# EasyEDA Pro project H桥.eprj, board 单相_TO220
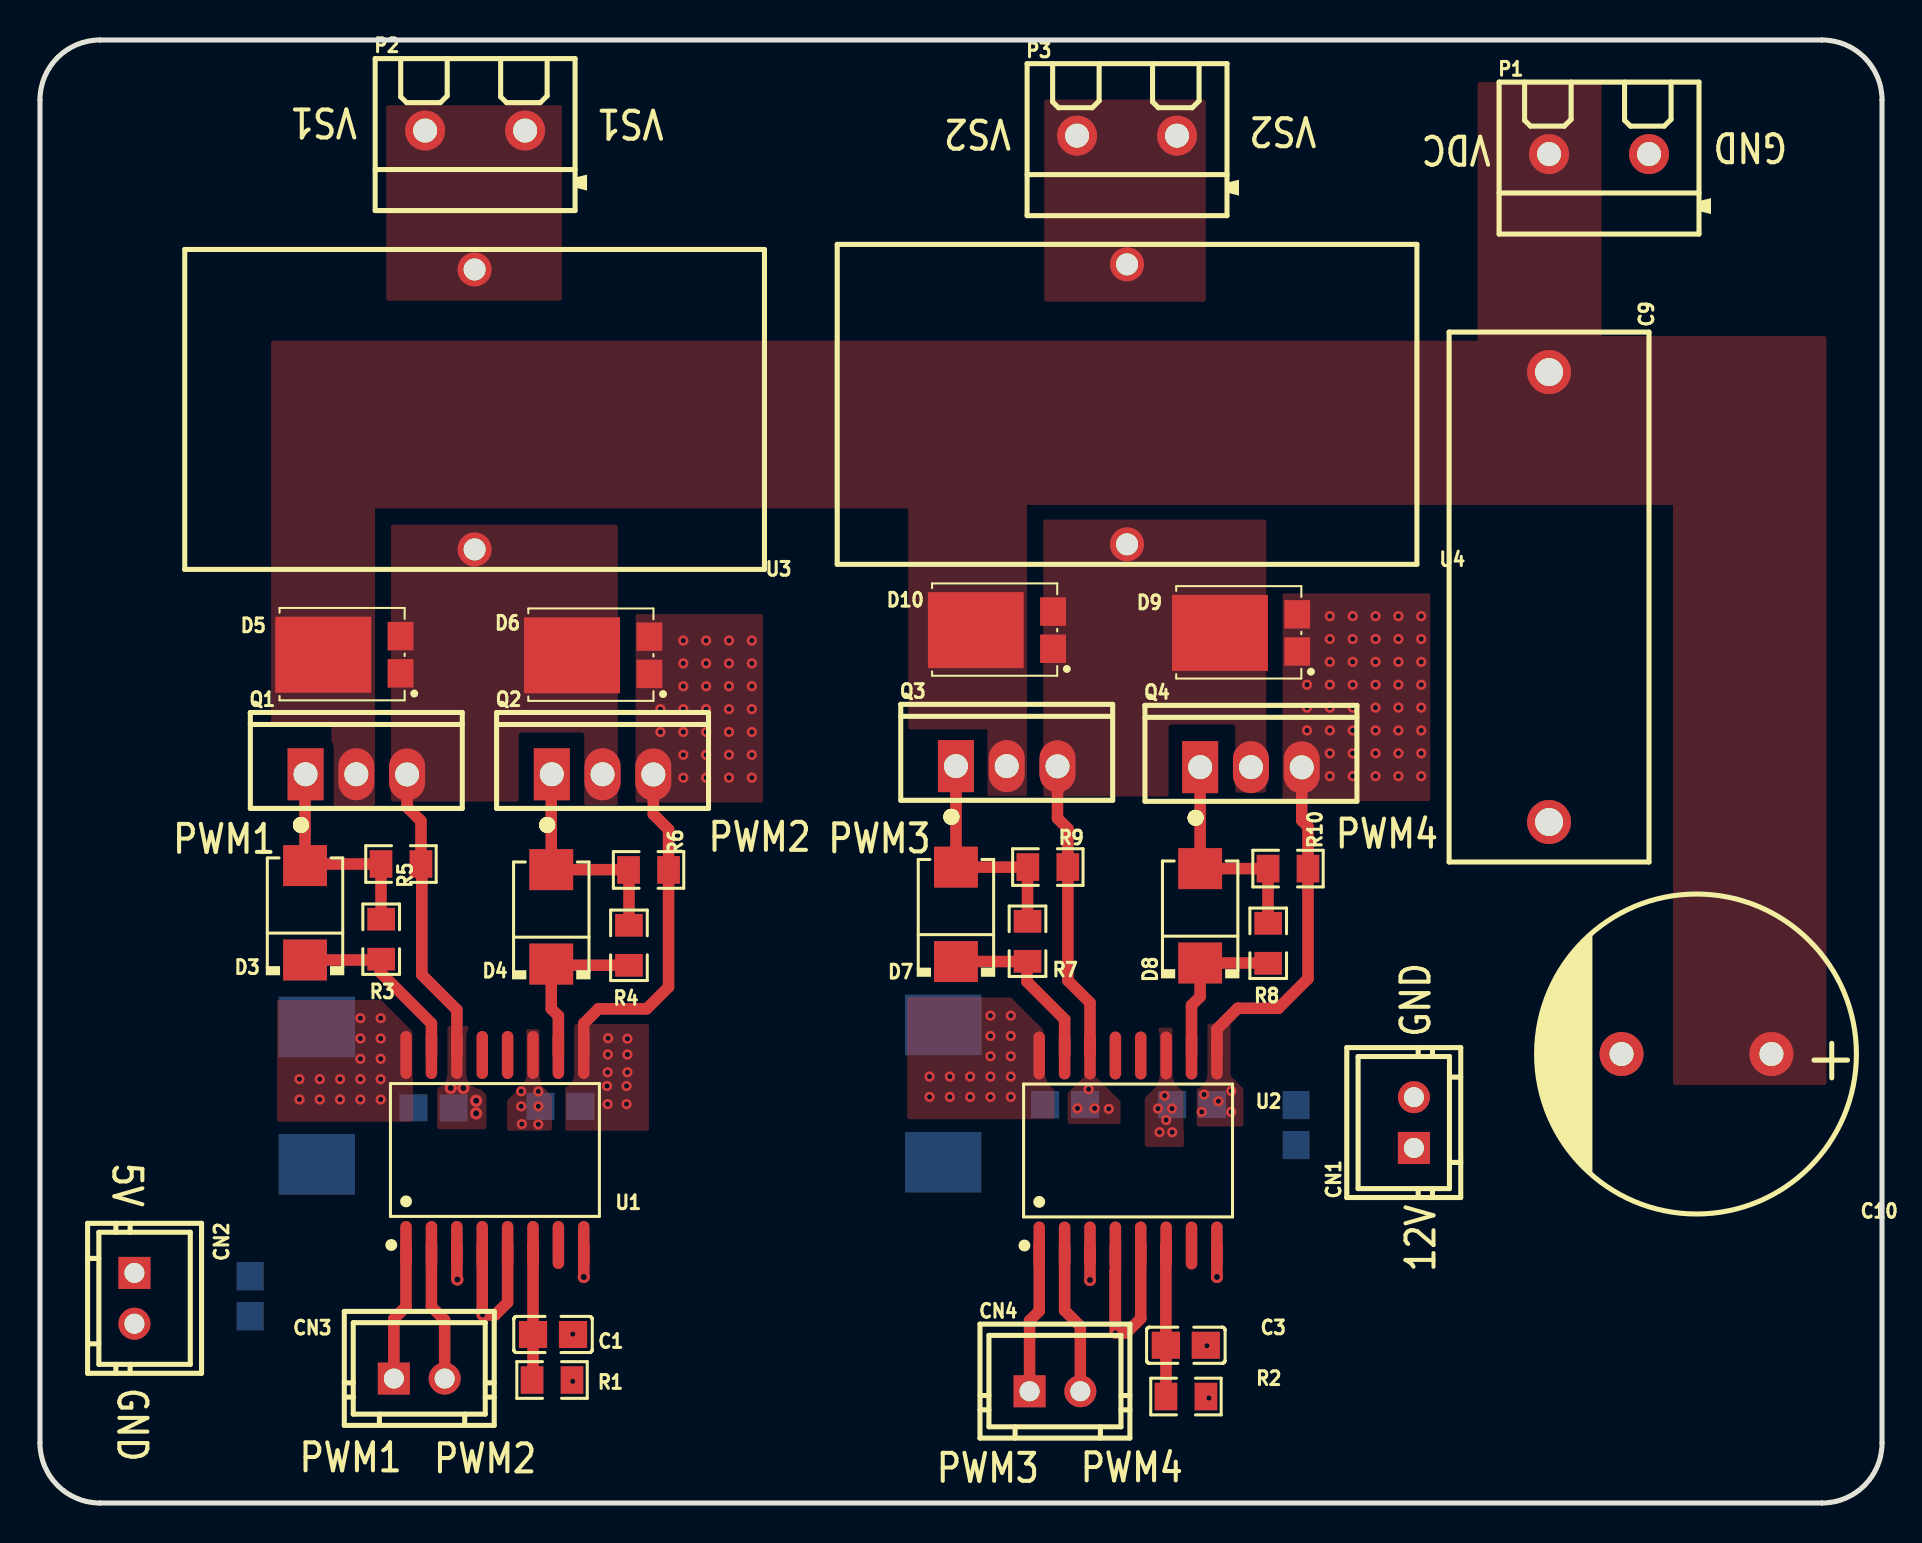
[diagram p3: board, top side]
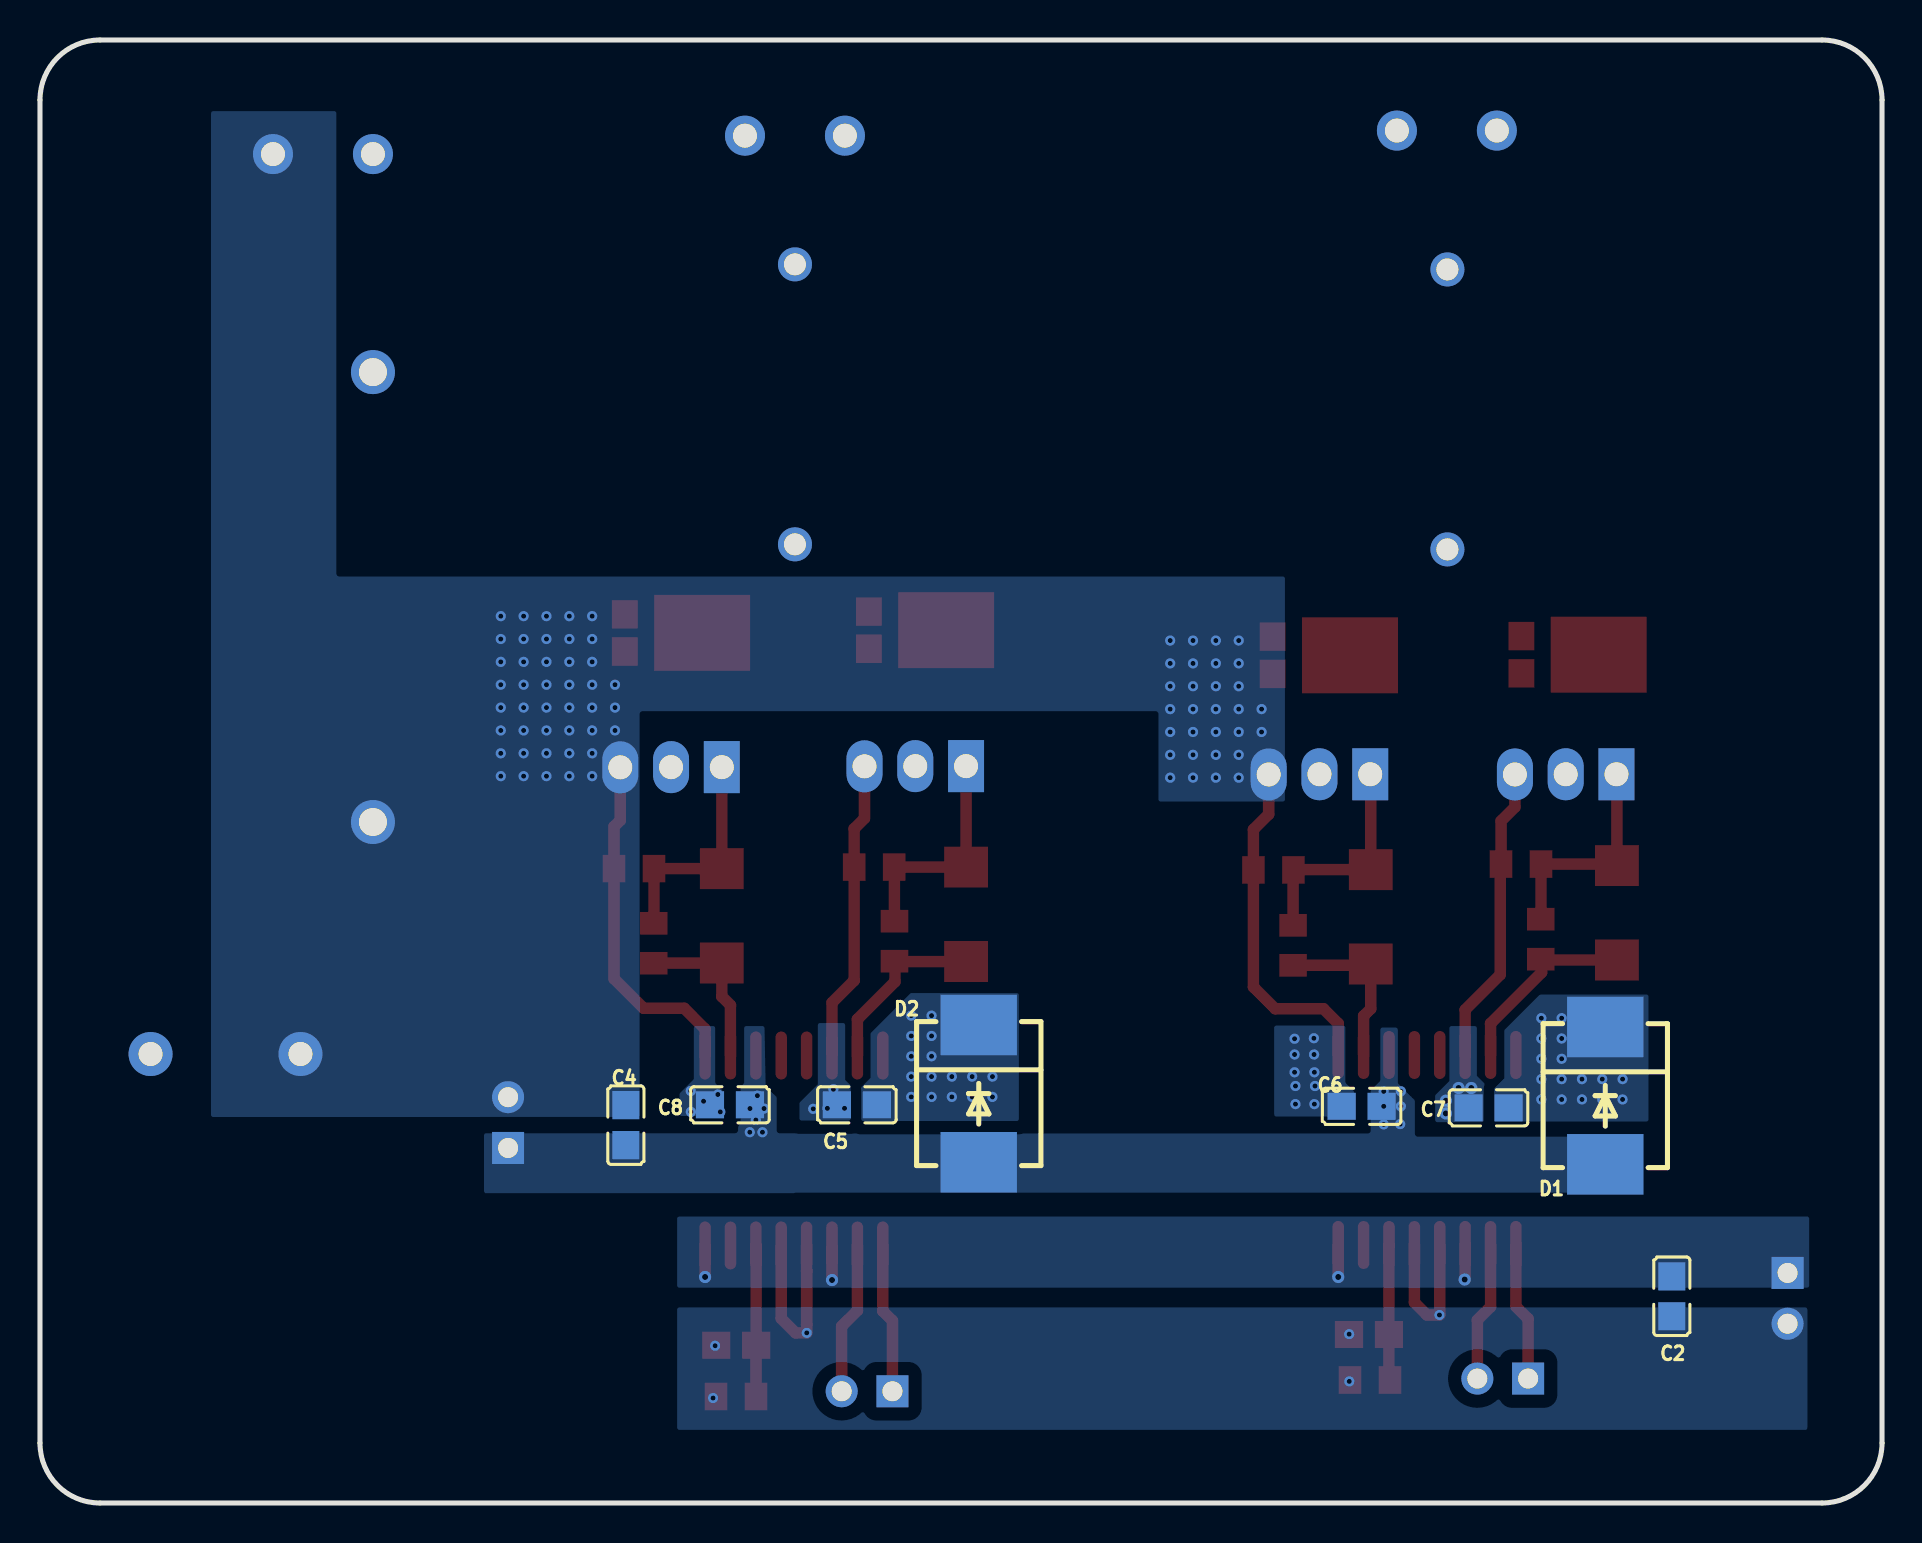
[diagram p4: board, bottom side, seen from below]

Outline 92.15 x 73.16 mm; copper layers: Top Layer, Bottom Layer. Coordinates in mm from the lower left corner of the outline.
Outline path: 0,70.16 0,3 arc(0.88,0.88) 3,0 89.15,0 arc(91.27,0.88) 92.15,3 92.15,70.16 arc(91.27,72.28) 89.15,73.16 3,73.16 arc(0.88,72.28) 0,70.16
Stack: Top Layer 0.035mm / Dielectric1 1.51mm FR4 er 4.5 / Bottom Layer 0.035mm

## Design rules (mm)
template: 自定义配置
spacing copperThickness1oz (default): track to track 0.508, other pairs 0.508 to 0.508
spacing copperThickness2oz: track to track 0.203, other pairs 0.152 to 0.3
track width copperThickness1oz (default): min 0.127, default 0.254, max 2.54
track width copperThickness2oz: min 0.203, default 0.254, max 2.54
differential pair differentialPair (default): width min 0.127, default 0.254, max 2.54; gap min 0.152, default 0.152
via viaSize (default): diameter min 0.5, default 0.508, max 10; hole min 0.127, default 0.254, max 6.3

## Placement (name value [footprint] x y rotation side)
C1  100nF  [C0805]  25.67 8.43 180 top
C2  100nF  [C0805]  10.52 10.34 90 bottom
C3  100nF  [C0805]  57.32 7.89 180 top
C4  100nF  [C0805]  62.84 18.9 270 bottom
C5  1uF  [C0805]  51.28 19.91 180 bottom
C6  1uF  [C0805]  26.03 19.84 180 bottom
C7  1uF  [C0805]  19.69 19.76 180 bottom
C8  1uF  [C0805]  57.63 19.91 180 bottom
C9  1uF  [CAP-TH_L26.5-W10.0-P22.50-D1.4]  75.49 45.3 270 top
C10  470uF  [CAP-TH_BD16.0-P7.50-D1.2-FD]  82.87 22.45 180 top
CN1  CON2-2.54*2P  [CONN-TH_2P-P2.54-V]  68.73 19.02 90 top
CN2  CON2-2.54*2P  [CONN-TH_2P-P2.54-V]  4.72 10.24 270 top
CN3  CON2-2.54*2P  [CONN-TH_2P-P2.54-V]  18.97 6.22 0 top
CN4  CON2-2.54*2P  [CONN-TH_2P-P2.54-V]  50.77 5.59 0 top
D1  RS3MC  [SMC_L7.1-W6.2-LS8.1-R-RD]  13.84 20.37 270 bottom
D2  RS3MC  [SMC_L7.1-W6.2-LS8.1-R-RD]  45.19 20.47 270 bottom
D3  SS34BG  [SMB_L4.6-W3.6-LS5.3-RD]  13.26 29.51 90 top
D4  SS34BG  [SMB_L4.6-W3.6-LS5.3-RD]  25.58 29.31 90 top
D5  ST20100L  [TO-277_3P-L5.7-W4.2-LS6.5-BR]  16.1 42.42 0 top
D6  ST20100L  [TO-277_3P-L5.7-W4.2-LS6.5-BR]  28.55 42.39 0 top
D7  SS34BG  [SMB_L4.6-W3.6-LS5.3-RD]  45.82 29.44 90 top
D8  SS34BG  [SMB_L4.6-W3.6-LS5.3-RD]  58.04 29.36 90 top
D9  ST20100L  [TO-277_3P-L5.7-W4.2-LS6.5-BR]  60.96 43.51 0 top
D10  ST20100L  [TO-277_3P-L5.7-W4.2-LS6.5-BR]  48.75 43.65 0 top
P1  KF301-2P接线端子  [CONN-TH_XY301V-A-5.0-2P]  77.99 67.45 0 top
P2  KF301-2P接线端子  [CONN-TH_XY301V-A-5.0-2P]  21.77 68.63 0 top
P3  KF301-2P接线端子  [CONN-TH_XY301V-A-5.0-2P]  54.38 68.38 0 top
Q1  CSD19536KCS  [TO-220-3_L10.0-W4.5-P2.54-L]  15.82 36.44 0 top
Q2  CSD19536KCS  [TO-220-3_L10.0-W4.5-P2.54-L]  28.14 36.44 0 top
Q3  CSD19536KCS  [TO-220-3_L10.0-W4.5-P2.54-L]  48.36 36.84 0 top
Q4  CSD19536KCS  [TO-220-3_L10.0-W4.5-P2.54-L]  60.58 36.79 0 top
R1  20kΩ  [R0805]  25.62 6.15 180 top
R2  20kΩ  [R0805]  57.33 5.32 180 top
R3  2Ω  [R0805]  17.07 28.19 90 top
R4  2Ω  [R0805]  29.46 27.89 90 top
R5  10kΩ  [R0805]  18.06 31.95 180 top
R6  10kΩ  [R0805]  30.45 31.66 180 top
R7  2Ω  [R0805]  49.4 28.09 90 top
R8  2Ω  [R0805]  61.44 27.99 90 top
R9  10kΩ  [R0805]  50.42 31.8 180 top
R10  10kΩ  [R0805]  62.43 31.72 180 top
U1  UCC21520  [SOIC-16_L10.3-W7.5-P1.27-LS10.3-BL]  22.76 17.65 0 top
U2  UCC21520  [SOIC-16_L10.3-W7.5-P1.27-LS10.3-BL]  54.43 17.63 0 top
U3  860uH  [IND-TH_L29.0-W16.0-P14.00-D0.8]  21.74 54.69 180 top
U4  860uH  [IND-TH_L29.0-W16.0-P14.00-D0.8]  54.38 54.94 180 top

## Footprints (pads in the part's own frame, mm; a bottom-side part is the same pattern mirrored in y, then rotated)
C0805
  rect 1.41x1.35 smd: 1(-1,0) 2(1,0)
CAP-TH_BD16.0-P7.50-D1.2-FD
  round 2.2 hole 1.2: 1(-3.75,0) 2(3.75,0)
CAP-TH_L26.5-W10.0-P22.50-D1.4
  round 2.2 hole 1.4: 1(-11.249,0) 2(11.249,0)
CONN-TH_2P-P2.54-V
  rect 1.6x1.6 hole 1: 1(-1.27,0)
  round 1.6 hole 1: 2(1.27,0)
CONN-TH_XY301V-A-5.0-2P
  round 2 hole 1.2: 1(-2.5,0) 2(2.5,0)
IND-TH_L29.0-W16.0-P14.00-D0.8
  round 1.7 hole 1.1: 1(0,7) 2(0,-7)
R0805
  rect 1.133x1.377 smd: 1(-1,0) 2(1,0)
SMB_L4.6-W3.6-LS5.3-RD
  rect 2.047x2.192 smd: 1(-2.361,0) 2(2.361,0)
SMC_L7.1-W6.2-LS8.1-R-RD
  rect 3.03x3.82 smd: 1(3.435,0) 2(-3.435,0)
SOIC-16_L10.3-W7.5-P1.27-LS10.3-BL
  oval 0.574x2.401 smd: 1(-4.445,-4.75) 2(-3.175,-4.75) 3(-1.905,-4.75) 4(-0.635,-4.75) 5(0.635,-4.75) 6(1.905,-4.75) 7(3.175,-4.75) 8(4.445,-4.75) 9(4.445,4.75) 10(3.175,4.75) 11(1.905,4.75) 12(0.635,4.75) 13(-0.635,4.75) 14(-1.905,4.75) 15(-3.175,4.75) 16(-4.445,4.75)
TO-220-3_L10.0-W4.5-P2.54-L
  rect 1.8x2.6 hole 1.2: 1(-2.54,0.005)
  oval 1.8x2.6 hole 1.2: 2(0,0.005) 3(2.54,-0.005)
TO-277_3P-L5.7-W4.2-LS6.5-BR
  rect 1.29x1.423 smd: 1(1.933,-0.93) 3(1.933,0.93)
  rect 4.8x3.8 smd: 2(-1.933,0)

## Nets
As in the schematic.

Pads without a net: U1 7 12 13; U2 7 12 13

## Via types
v1: diameter 0.508, hole 0.254, Top Layer to Bottom Layer, 142 vias
v2: diameter 0.61, hole 0.305, Top Layer to Bottom Layer, 8 vias

## Routing (per net, layer and track width the routed paths; a pad name or vN(x,y) marks a point on that pad's centre or on a via; arc(x,y) is an arc through that point)
+5V: length 6.6
  Top Layer w0.574: U1.8 v2(27.2,11.3) ; U2.8 v2(58.88,11.3) ; U1.3 20.85,11.2 v2(20.88,11.18) ; U2.3 v2(52.53,11.15)
+12V:
  vias: v1(24.07,20.59) v1(24.07,19.84) v1(24.1,18.95) v1(24.93,20.58) v1(24.93,19.84) v1(24.93,18.93) v1(55.93,19.73) v1(56.01,18.54) v1(56.26,20.37) v1(56.34,19.15) v1(56.63,19.73) v1(56.64,18.54)
DGND: length 20.2
  Top Layer w0.574: U2.5 55.07,9.23 54.35,8.51 v1(53.79,8.51) 53.79,8.91 ; 53.8,11.61 53.8,8.91 53.79,8.91 ; 53.8,11.61 U2.4 ; 53.8,11.61 53.79,11.6 53.79,8.91 ; U1.4 22.12,9.42 v1(22.14,9.4) 22.77,9.4 23.39,10.03 U1.5
  vias: v1(26.66,8.44) v1(26.65,6.08) v1(58.37,7.86) v1(58.48,5.25)
PGND: length 35.1
  Top Layer w0.574: Q2.3 30.68,34.44 31.45,33.68 R6.1 31.45,25.81 30.35,24.71 27.94,24.71 27.2,23.98 27.2,22.4 ; Q4.3 63.12,34.14 63.43,33.82 R10.1 63.43,26.22 61.95,24.74 59.92,24.74 58.88,23.7 U2.9
  vias: v1(28.42,23.24) v1(28.41,22.43) v1(28.4,21.54) v1(28.37,20.85) v1(28.4,19.95) v1(29.34,20.85) v1(29.34,19.95) v1(29.39,23.22) v1(29.39,22.43) v1(29.39,21.54) v1(31.04,39.7) v1(31.04,38.56) v1(32.18,43.13) v1(32.18,41.99) v1(32.18,40.84) v1(32.18,39.7) v1(32.18,38.56) v1(32.18,37.41) v1(32.18,36.27) v1(33.32,43.13) v1(33.32,41.99) v1(33.32,40.84) v1(33.32,39.7) v1(33.32,38.56) v1(33.32,37.41) v1(33.32,36.27) v1(34.47,43.13) v1(34.47,41.99) v1(34.47,40.84) v1(34.47,39.7) v1(34.47,38.56) v1(34.47,37.41) v1(34.47,36.27) v1(35.61,43.13) v1(35.61,41.99) v1(35.61,40.84) v1(35.61,39.7) v1(35.61,38.56) v1(35.61,37.41) v1(35.61,36.27) v1(58.12,19.56) v1(58.24,20.43) v1(58.95,20.09) v1(59.6,20.6) v1(59.59,19.56) v1(63.38,40.92) v1(63.38,39.78) v1(63.38,38.63) v1(64.53,44.35) v1(64.53,43.2) v1(64.53,42.06) v1(64.53,40.92) v1(64.53,39.78) v1(64.53,38.63) v1(64.53,37.49) v1(64.53,36.35) v1(65.67,44.35) v1(65.67,43.2) v1(65.67,42.06) v1(65.67,40.92) v1(65.67,39.78) v1(65.67,38.63) v1(65.67,37.49) v1(65.67,36.35) v1(66.81,44.35) v1(66.81,43.2) v1(66.81,42.06) v1(66.81,40.92) v1(66.81,39.78) v1(66.81,38.63) v1(66.81,37.49) v1(66.81,36.35) v1(67.96,44.35) v1(67.96,43.2) v1(67.96,42.06) v1(67.96,40.92) v1(67.96,39.78) v1(67.96,38.63) v1(67.96,37.49) v1(67.96,36.35) v1(69.1,44.35) v1(69.1,43.2) v1(69.1,42.06) v1(69.1,40.92) v1(69.1,39.78) v1(69.1,38.63) v1(69.1,37.49) v1(69.1,36.35)
H1: length 9.6
  Top Layer w0.574: 17.03,27.15 17.03,26.53 19.58,23.98 19.58,22.4 ; 17.03,27.15 R3.1 ; 17.03,27.15 D3.1
H2: length 8.8
  Top Layer w0.574: U2.15 51.26,24.19 49.38,26.07 49.38,26.82 ; D7.1 49.39,27.08
L1: length 8.6
  Top Layer w0.574: R4.1 25.64,26.89 D4.1 25.58,24.71 25.93,24.36 25.93,22.4
L2: length 8.2
  Top Layer w0.574: R8.1 61.43,27 D8.1 58.04,25.32 57.61,24.89 U2.10
PWM1: length 6.9
  Top Layer w0.574: CN3.1 17.7,9.22 18.31,9.82 U1.1
PWM2: length 7
  Top Layer w0.574: U1.2 19.58,9.81 20.24,9.15 CN3.2
PWM3: length 7.5
  Top Layer w0.574: U2.1 49.99,9.6 49.5,9.12 CN4.1
PWM4: length 7.6
  Top Layer w0.574: CN4.2 52.04,8.84 51.26,9.63 U2.2
VS1: length 15.1
  Top Layer w0.574: Q1.3 18.36,34.8 19.06,34.1 R5.1 19.1,31.91 19.1,26.42 20.85,24.66 20.85,22.4
  vias: v2(20.55,20.75) v2(21.18,20.75) v2(21.82,20.12) v2(21.82,19.48)
VS2: length 15.1
  Top Layer w0.574: U2.14 52.53,25.02 51.42,26.13 R9.1 51.42,33.72 50.9,34.24 Q3.3
  vias: v1(51.9,19.74) v1(52.46,20.69) v1(52.76,19.74) v1(53.47,19.71)
$1N1918: length 11.4
  Top Layer w0.574: Q2.1 25.58,36.42 D4.2 29.43,31.67 R6.2 29.46,31.64 R4.2
$1N1920: length 11.2
  Top Layer w0.574: Q1.1 13.26,36.42 13.26,31.88 13.34,31.95 17.06,31.95 ; R5.2 17.06,29.2 R3.2
$1N1922: length 11.4
  Top Layer w0.574: R7.2 49.4,31.78 49.42,31.8 D7.2 Q3.1
$1N1924: length 11.2
  Top Layer w0.574: 61.43,31.72 D8.2 Q4.1 ; R10.2 61.43,29 R8.2
$1N1931: length 7.6
  Top Layer w0.574: R2.2 56.33,7.88 C3.2 56.32,12.86 U2.6
$1N1939: length 6.8
  Top Layer w0.574: R1.2 24.67,6.2 C1.2 24.67,12.9 U1.6
$1N1949:
  vias: v1(44.5,21.32) v1(44.5,20.31) v1(45.52,21.32) v1(45.52,20.31) v1(46.53,21.32) v1(46.53,20.31) v1(47.55,24.37) v1(47.55,23.36) v1(47.55,22.34) v1(47.55,21.32) v1(47.55,20.31) v1(48.56,24.37) v1(48.56,23.36) v1(48.56,22.34) v1(48.56,21.32) v1(48.56,20.31)
$1N1950:
  vias: v1(12.98,21.2) v1(12.98,20.18) v1(14,21.2) v1(14,20.18) v1(15.01,21.2) v1(15.01,20.18) v1(16.03,24.24) v1(16.03,23.23) v1(16.03,22.21) v1(16.03,21.2) v1(16.03,20.18) v1(17.04,24.24) v1(17.04,23.23) v1(17.04,22.21) v1(17.04,21.2) v1(17.04,20.18)

## Copper pours and planes (outline as drawn; the poured copper is in the pictures)
+5V on Bottom Layer: 3.51,10.62 60.43,10.62 60.43,14.48 3.49,14.48 3.49,10.64
+12V on Top Layer: 24.05,23.85 25.22,23.85 25.22,20.95 25.78,20.4 25.78,18.47 23.22,18.47 23.22,20.2 24.04,21.02 24.04,23.84
+12V on Top Layer: 55.78,23.93 56.95,23.93 56.95,21.06 57.38,20.62 57.38,17.65 55.12,17.65 55.12,20.32 55.77,20.97 55.77,23.92
+12V on Bottom Layer: 57.38,20.75 57.38,18.64 70.09,18.64 70.09,15.34 54.34,15.34 54.34,15.37 11.88,15.37 11.88,18.47 23.22,18.47 23.22,20.19 24.07,21.05 24.07,23.93 25.22,23.93 25.25,23.9 25.25,21.17 25.73,20.69 25.73,18.63 54.34,18.63 54.34,18.64 55.14,18.64 55.14,20.35 55.7,20.91 55.76,24 57.07,24 57.07,21.06
+VIN on Top Layer: 78.12,71.05 78.12,58.35 89.37,58.35 89.37,20.9 81.69,20.9 81.69,49.91 49.38,49.91 49.38,35.36 47.4,35.36 47.4,38.68 43.43,38.68 43.43,49.73 16.76,49.73 16.76,34.87 14.58,34.87 14.58,38.86 14.61,38.89 11.58,38.89 11.56,38.91 11.56,58.12 71.92,58.12 71.92,71.05
DGND on Bottom Layer: 3.58,9.93 60.43,9.93 60.43,3.5 3.58,3.5
PGND on Top Layer: 57.86,18.82 60.2,18.82 60.2,20.72 59.56,21.36 59.56,23.98 58.32,23.98 58.32,21.34 57.86,20.88
PGND on Top Layer: 29.64,44.6 36.32,44.6 36.32,34.87 29.64,34.87
PGND on Top Layer: 26.27,18.62 30.47,18.62 30.47,23.95 26.68,23.95 26.68,21.31 26.27,20.9
PGND on Top Layer: 61.98,45.64 69.7,45.64 69.7,34.95 61.98,34.95
PGND on Bottom Layer: 57.76,19.2 60.3,19.2 60.3,20.55 59.59,21.26 59.59,24 58.22,24 58.22,21.06 57.76,20.6
PGND on Bottom Layer: 83.74,19.15 62,19.15 62,39.45 36.35,39.45 36.35,34.93 36.34,34.92 29.79,34.92 29.72,35 29.72,46.48 77.17,46.48 77.17,69.75 83.74,69.75
PGND on Bottom Layer: 26.24,19.18 30.56,19.18 30.56,24.03 26.7,24.03 26.7,21.08 26.24,20.62
BRIDGE1 on Top Layer: 17.17,70.05 26.26,70.05 26.26,59.97 17.17,59.97
BRIDGE2 on Top Layer: 50.09,70.33 58.47,70.33 58.47,59.92 50.09,59.92
VS1 on Top Layer: 19.86,18.69 22.33,18.69 22.33,20.42 21.51,21.23 21.51,23.85 20.27,23.85 20.27,21.36 19.86,20.95
VS1 on Top Layer: 17.4,34.92 17.4,49.07 29.06,49.07 29.06,34.73 27.14,34.73 27.08,34.67 27.08,38.37 24.1,38.37 24.1,34.92
VS1 on Bottom Layer: 19.81,19.05 22.36,19.05 22.36,20.39 21.64,21.11 21.64,23.85 20.27,23.85 20.27,21.36 19.81,20.9
VS2 on Top Layer: 50.04,35.18 50.04,49.33 61.49,49.33 61.49,35.37 59.64,35.37 59.64,38.78 56.61,38.78 56.61,35.18
VS2 on Top Layer: 51.41,18.95 54.05,18.95 54.05,20.09 52.81,21.34 52.81,23.98 52.25,23.98 52.25,21.34 51.41,20.5
VS2 on Bottom Layer: 51.54,19.13 54.16,19.13 54.16,20.01 53.24,20.93 53.24,24 51.87,24 51.87,21.16 51.54,20.83
$1N1949 on Top Layer: 43.23,25.44 43.23,19.04 51.14,19.04 51.14,20.71 50.34,21.5 50.34,23.74 48.64,25.44
$1N1949 on Bottom Layer: 43.18,25.5 43.18,19.1 51.09,19.1 51.09,20.77 50.6,21.26 50.6,23.49 48.59,25.5
$1N1950 on Top Layer: 11.71,25.31 11.71,18.91 18.82,18.91 18.82,23.61 17.12,25.31
$1N1950 on Bottom Layer: 11.68,25.42 11.68,19.08 19.41,19.08 19.41,20.72 18.9,21.23 18.9,23.65 17.12,25.42

## Text on the board
Top Silkscreen Layer: PWM1 | PWM2 | PWM3 | PWM4 | VS1 | VS2 | VDC | GND | 5V | 12V
